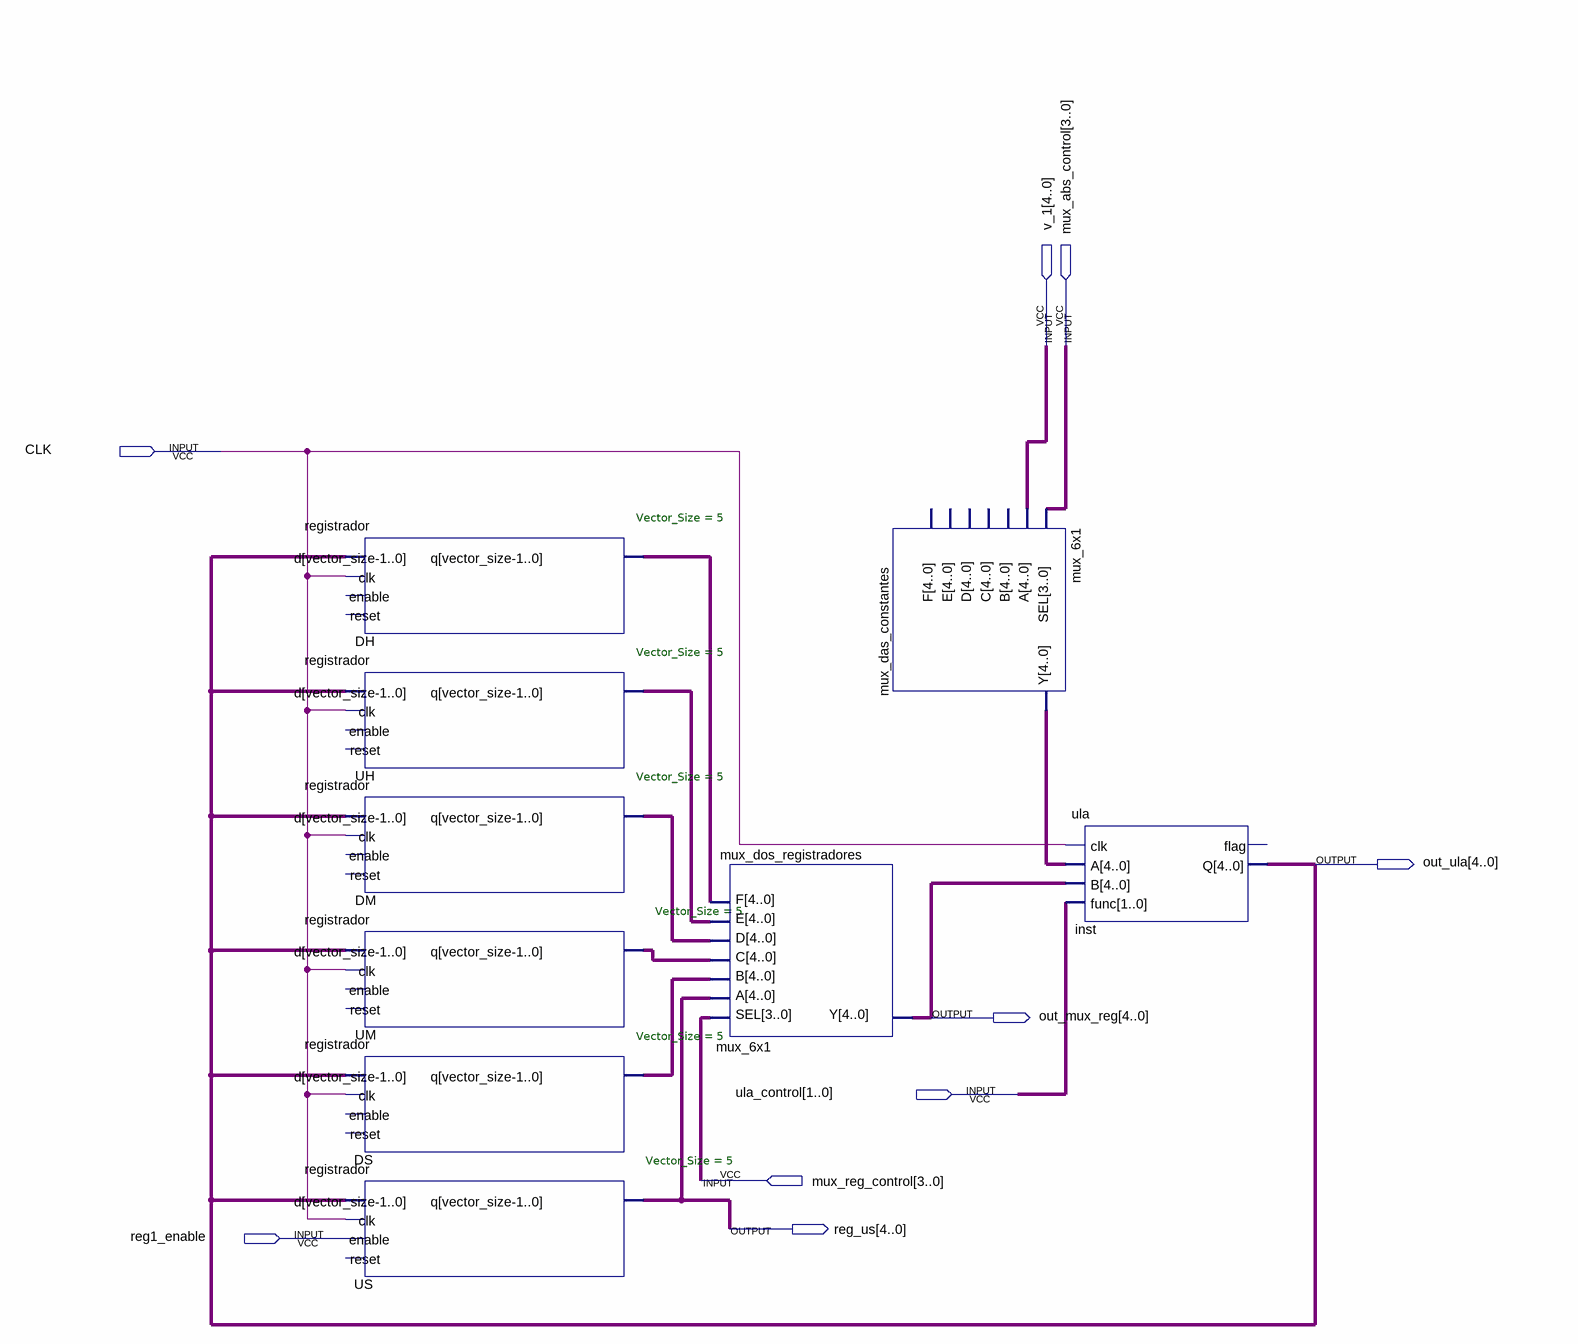
[diagram p0: schematic sheet]
// Quartus schematic diagrama_de_blocos_relogio.bdf as structural Verilog: 9 symbols, 9 pins
module diagrama_de_blocos_relogio (
  input  [4:0] v_1,
  input  [3:0] mux_abs_control,
  input  CLK,
  input  [1:0] ula_control,
  input  [3:0] mux_reg_control,
  input  reg1_enable,
  output [4:0] out_ula,
  output [4:0] out_mux_reg,
  output [4:0] reg_us
);

  wire [4:0] DH_q, DM_q, DS_q, mux_das_constantes_y, UH_q, UM_q;

  registrador #(.Vector_Size(5)) DH (.d(out_ula), .clk(CLK), .q(DH_q));  // open: enable, reset
  registrador #(.Vector_Size(5)) UH (.d(out_ula), .clk(CLK), .q(UH_q));  // open: enable, reset
  registrador #(.Vector_Size(5)) DM (.d(out_ula), .clk(CLK), .q(DM_q));  // open: enable, reset
  registrador #(.Vector_Size(5)) UM (.d(out_ula), .clk(CLK), .q(UM_q));  // open: enable, reset
  registrador #(.Vector_Size(5)) DS (.d(out_ula), .clk(CLK), .q(DS_q));  // open: enable, reset
  registrador #(.Vector_Size(5)) US (.d(out_ula), .clk(CLK), .enable(reg1_enable), .q(reg_us));  // open: reset
  mux_6x1 mux_dos_registradores (
    .SEL(mux_reg_control), .A(reg_us), .B(DS_q), .C(UM_q), .D(DM_q), .E(UH_q), .F(DH_q), .Y(out_mux_reg));
  mux_6x1 mux_das_constantes (.SEL(mux_abs_control), .A(v_1), .Y(mux_das_constantes_y));  // open: B, C, D, E, F
  ula inst (.clk(CLK), .A(mux_das_constantes_y), .B(out_mux_reg), .func(ula_control), .Q(out_ula));  // open: flag
endmodule
